# EAGLE schematic current_source (EAGLE 7.4.0)
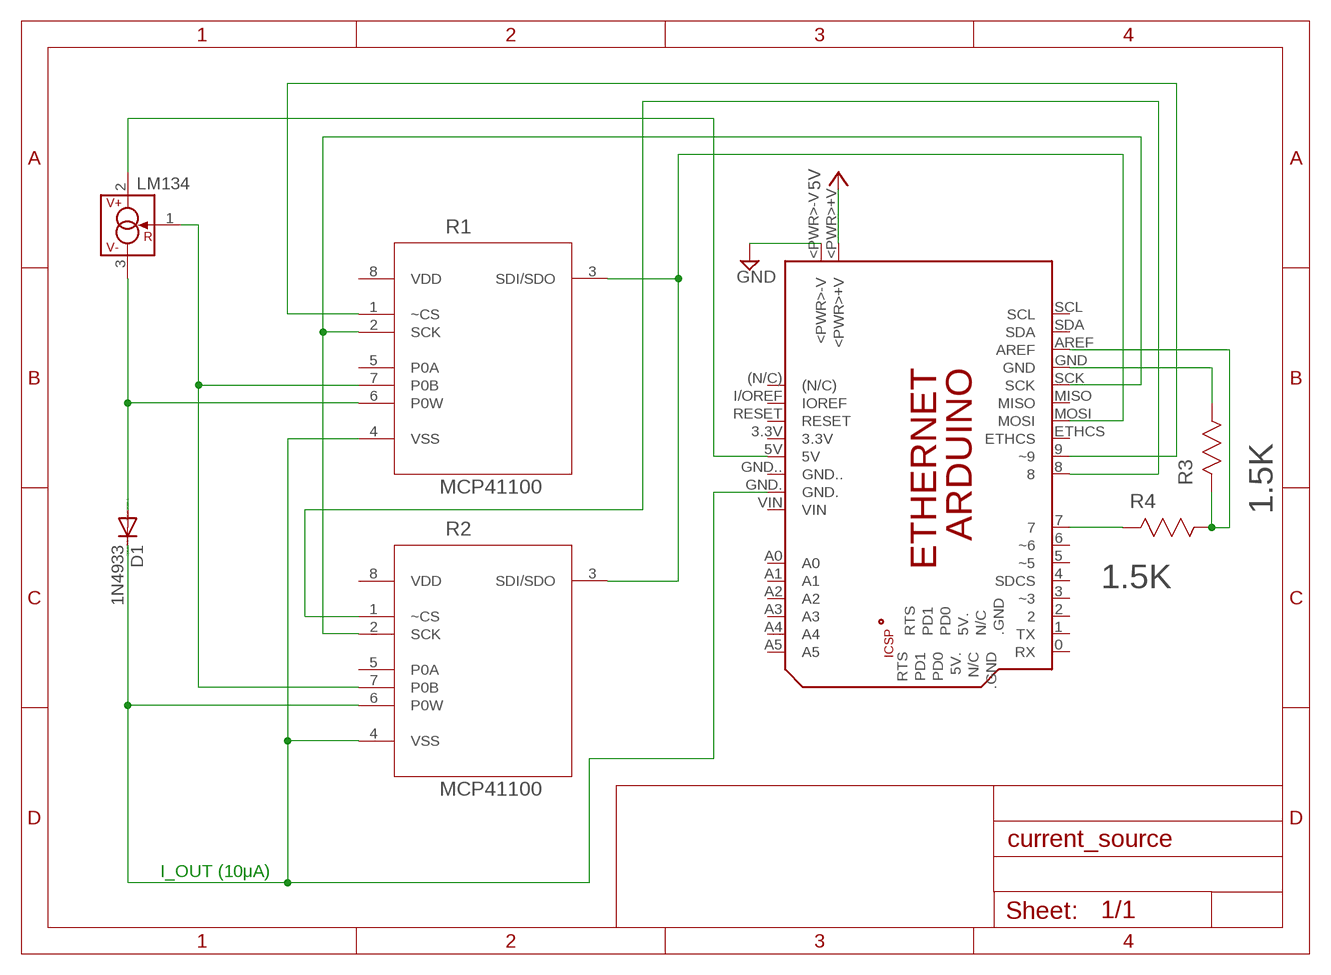
[diagram p0: schematic, sheet 1]

## Parts
D1  1N4933  [DO41-10]
LM134  LM134H  [TO46]
PCB1  ARDUINO_ETHERNET  [ARDUINO_ETHERNET]
R1  MCP41100  [DIP254P762X533-8]
R2  MCP41100  [DIP254P762X533-8]
R3  1.5K  CRCW12101K50FKEA  [RESC3225X71N]
R4  1.5K  CRCW12101K50FKEA  [RESC3225X71N]

## Nets
GND: PCB1.<PWR>-V
I_OUT: D1.C PCB1.GND. R1.4(VSS) R2.4(VSS) R2.6(P0W)
N$1: LM134.1(R) R1.7(P0B) R2.7(P0B)
N$2: D1.A LM134.3(V-) R1.6(P0W)
N$3: LM134.2(V+) PCB1.5V
N$4: PCB1.8 R2.1(~CS)
N$5: PCB1.9(~9) R1.1(~CS)
N$6: PCB1.SCK R1.2(SCK) R2.2(SCK)
N$7: PCB1.MOSI R1.3(SDI/SDO) R2.3(SDI/SDO)
N$8: PCB1.7 R4.2
N$9: PCB1.GND R3.1
N$10: PCB1.AREF R3.2 R4.1
VCC: PCB1.<PWR>+V ; supply symbol labelled 5V
Unconnected: PCB1.0(RX) PCB1.1(TX) PCB1.2 PCB1.3(~3) PCB1.3.3V PCB1.4(SDCS) PCB1.5(~5) PCB1.5V. PCB1.6(~6) PCB1.(N/C) PCB1.+5V. PCB1..GND PCB1.A0 PCB1.A1 PCB1.A2 PCB1.A3 PCB1.A4 PCB1.A5 PCB1.ETHCS PCB1.GND.. PCB1.GND_ PCB1.I/OREF(IOREF) PCB1.MISO PCB1.MISO. PCB1.MOSI. PCB1.N/C PCB1.PD0 PCB1.PD1 PCB1.RESET PCB1.RESET. PCB1.RTS PCB1.SCK. PCB1.SCL PCB1.SDA PCB1.VIN R1.5(P0A) R2.5(P0A)

## Notes on the sheet
- I_OUT (10μA)

## Power pins joined to a net without a drawn wire
VDD: R1.8(VDD) R2.8(VDD)

## Library data of the parts
D1 = diode:1N4933: DIODE fast recovery rectifier, 1A
LM134 = linear:LM*34: 3-Terminal Adjustable Current Sources Source: www.national.com/pf/LM/LM334.html | LM134.pdf
PCB1 = E14_Arduino_revB:ARDUINO_ETHERNET: Device for representing an Arduino Ethernet board with a footprint in an EAGLE design. Created by Dave Young for Element14. More EAGLE documentation at: http://www.element14.com/community/community/knode/cadsoft_eagle
R1 R2 = Microchip_By_element14_Batch_1:MCP41100: Single/Dual SPI Digital POT; PACKAGE: DIP-8; SUPPLIER: MICROCHIP
R3 R4 = Vishay_By_element14_Batch_1:CRCW12101K50FKEA: RESISTOR, 1210; MPN: CRCW12101K50FKEA; OC_FARNELL: 1153384; OC_NEWARK: 53K2759; SUPPLIER: Vishay; TOLERANCE: ±1%; VALUE: 1.5K Ohm; WATTAGE: 0.5W